# EAGLE design RPi_SPI_inputs_v01 (EAGLE 7.2.0)
AUTHOR: Petrilak M.; VERSION: 01
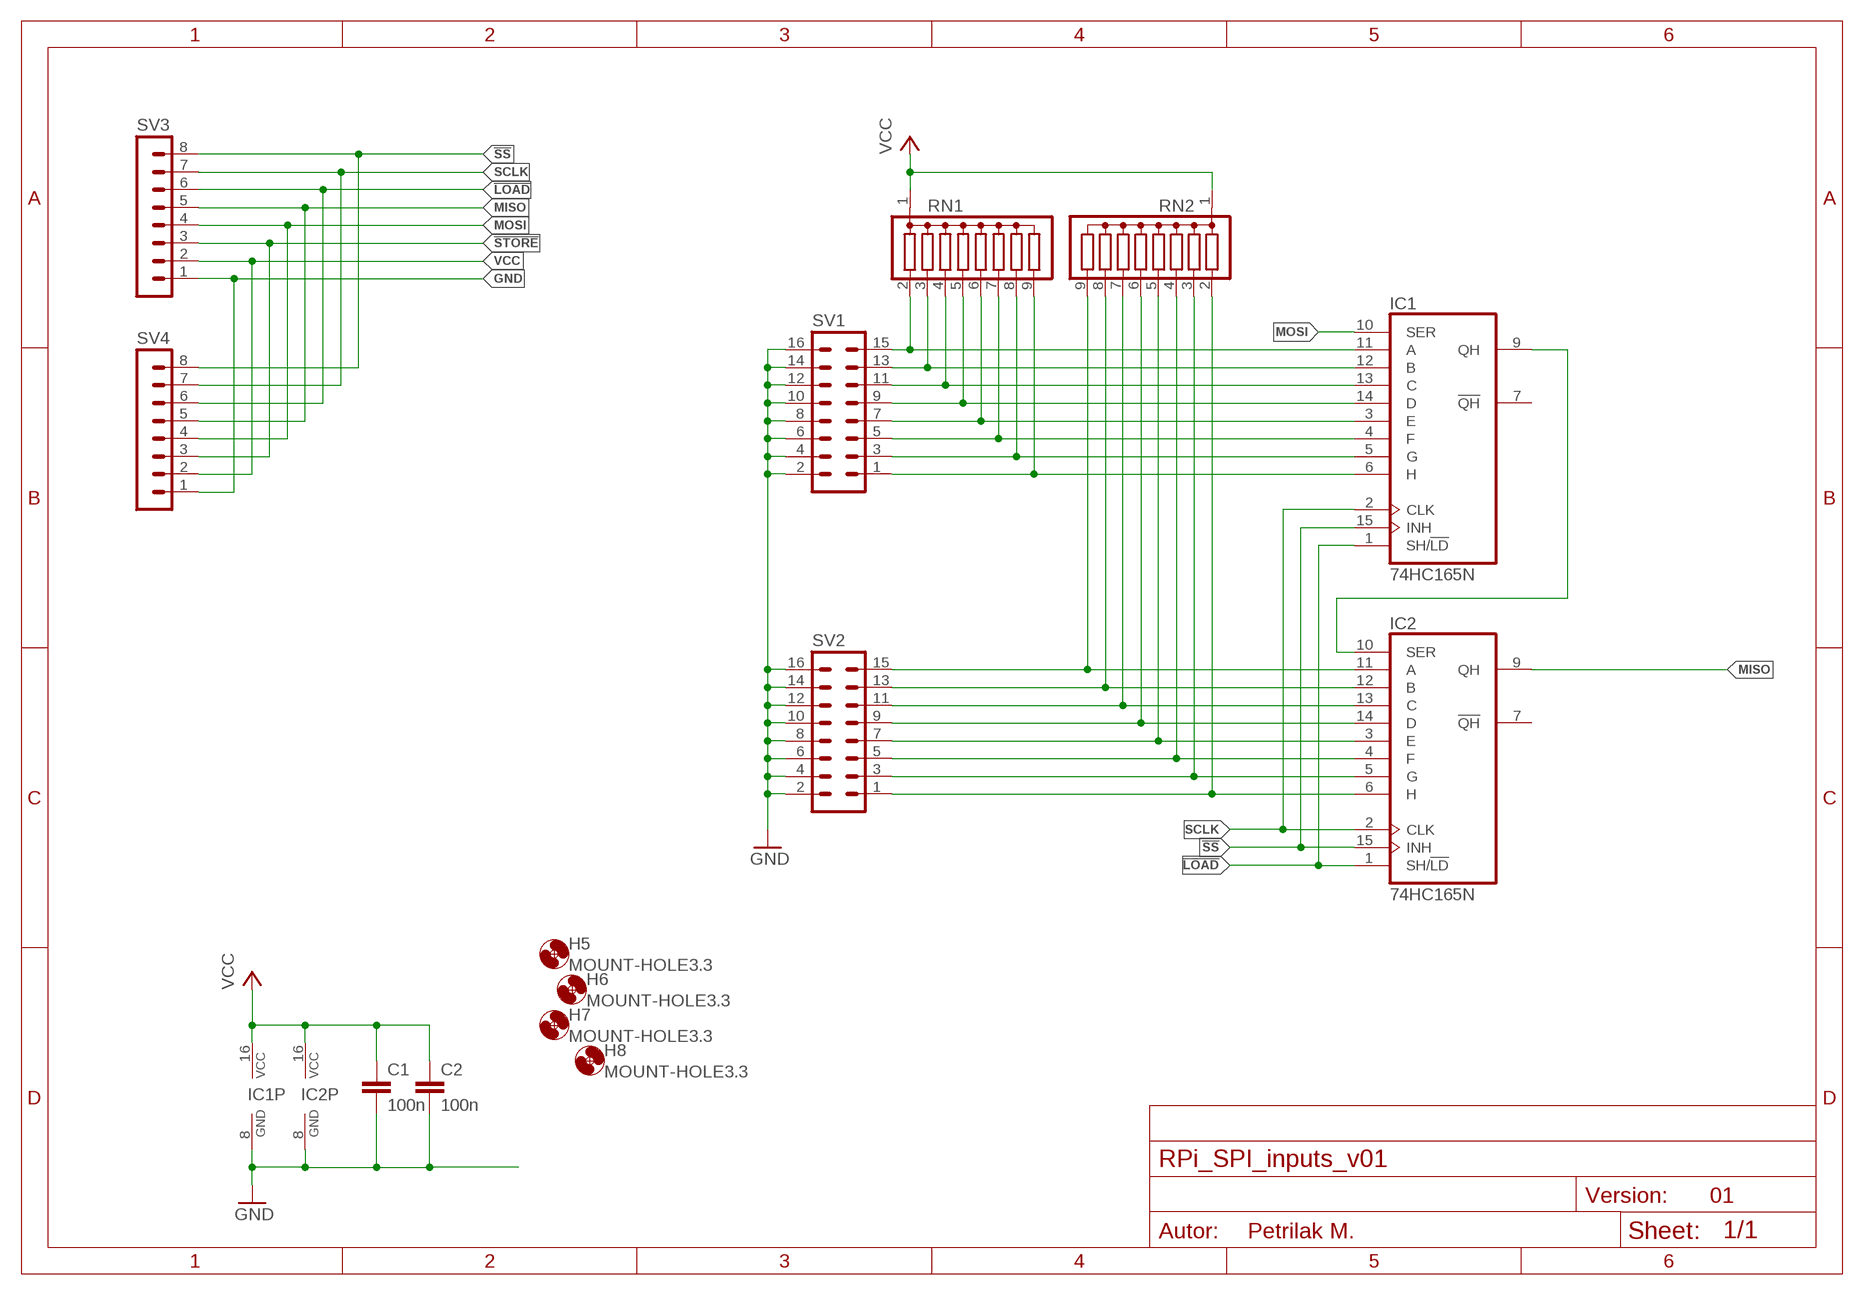
[diagram p0: schematic, sheet 1]

## Parts
C1  100n  C-EUC1206  [C1206]
C2  100n  C-EUC1206  [C1206]
H5  MOUNT-HOLE3.3  [3,3]
H6  MOUNT-HOLE3.3  [3,3]
H7  MOUNT-HOLE3.3  [3,3]
H8  MOUNT-HOLE3.3  [3,3]
IC1  74HC165N  [DIL16]
IC2  74HC165N  [DIL16]
RN1  G08R  [SIL9]
RN2  G08R  [SIL9]
SV1  MA08-2-OP  [MA08-2-OP]
SV2  MA08-2-OP  [MA08-2-OP]
SV3  MA08-1  [MA08-1]
SV4  MA08-1  [MA08-1]

## Nets
!LOAD: IC1.1(SH/!LD) IC2.1(SH/!LD) SV3.6 SV4.6
!SS: IC1.15(INH) IC2.15(INH) SV3.8 SV4.8
!STORE: SV3.3 SV4.3
GND: C1.2 C2.2 IC1.8(GND) IC2.8(GND) SV1.2 SV1.4 SV1.6 SV1.8 SV1.10 SV1.12 SV1.14 SV1.16 SV2.2 SV2.4 SV2.6 SV2.8 SV2.10 SV2.12 SV2.14 SV2.16 SV3.1 SV4.1
I00: IC1.11(A) RN1.2 SV1.15
I01: IC1.12(B) RN1.3 SV1.13
I06: IC1.5(G) RN1.8 SV1.3
I07: IC1.6(H) RN1.9 SV1.1
I08: IC2.11(A) RN2.9 SV2.15
I09: IC2.12(B) RN2.8 SV2.13
I10: IC2.13(C) RN2.7 SV2.11
I11: IC2.14(D) RN2.6 SV2.9
I12: IC2.3(E) RN2.5 SV2.7
I13: IC2.4(F) RN2.4 SV2.5
I14: IC2.5(G) RN2.3 SV2.3
I15: IC2.6(H) RN2.2 SV2.1
MISO: IC2.9(QH) SV3.5 SV4.5
MOSI: IC1.10(SER) SV3.4 SV4.4
N$1: IC1.9(QH) IC2.10(SER)
N$9: IC1.4(F) RN1.7 SV1.5
N$10: IC1.3(E) RN1.6 SV1.7
N$11: IC1.14(D) RN1.5 SV1.9
N$12: IC1.13(C) RN1.4 SV1.11
SCLK: IC1.2(CLK) IC2.2(CLK) SV3.7 SV4.7
VCC: C1.1 C2.1 IC1.16(VCC) IC2.16(VCC) RN1.1 RN2.1 SV3.2 SV4.2
Unconnected: IC1.7(!QH) IC2.7(!QH)

## Library data of the parts
C1 C2 = rcl:C-EU: CAPACITOR, European symbol
H5-H8 = holes:MOUNT-HOLE: MOUNTING HOLE with drill center marker
IC1 IC2 = 74xx-eu:74*165: 8-bit parallel load SHIFT REGISTER
RN1 RN2 = resistor-sil:G08R: SIL RESISTOR
SV1 SV2 = con-lstb:MA08-2: PIN HEADER
SV3 SV4 = con-lstb:MA08-1: PIN HEADER

## Board
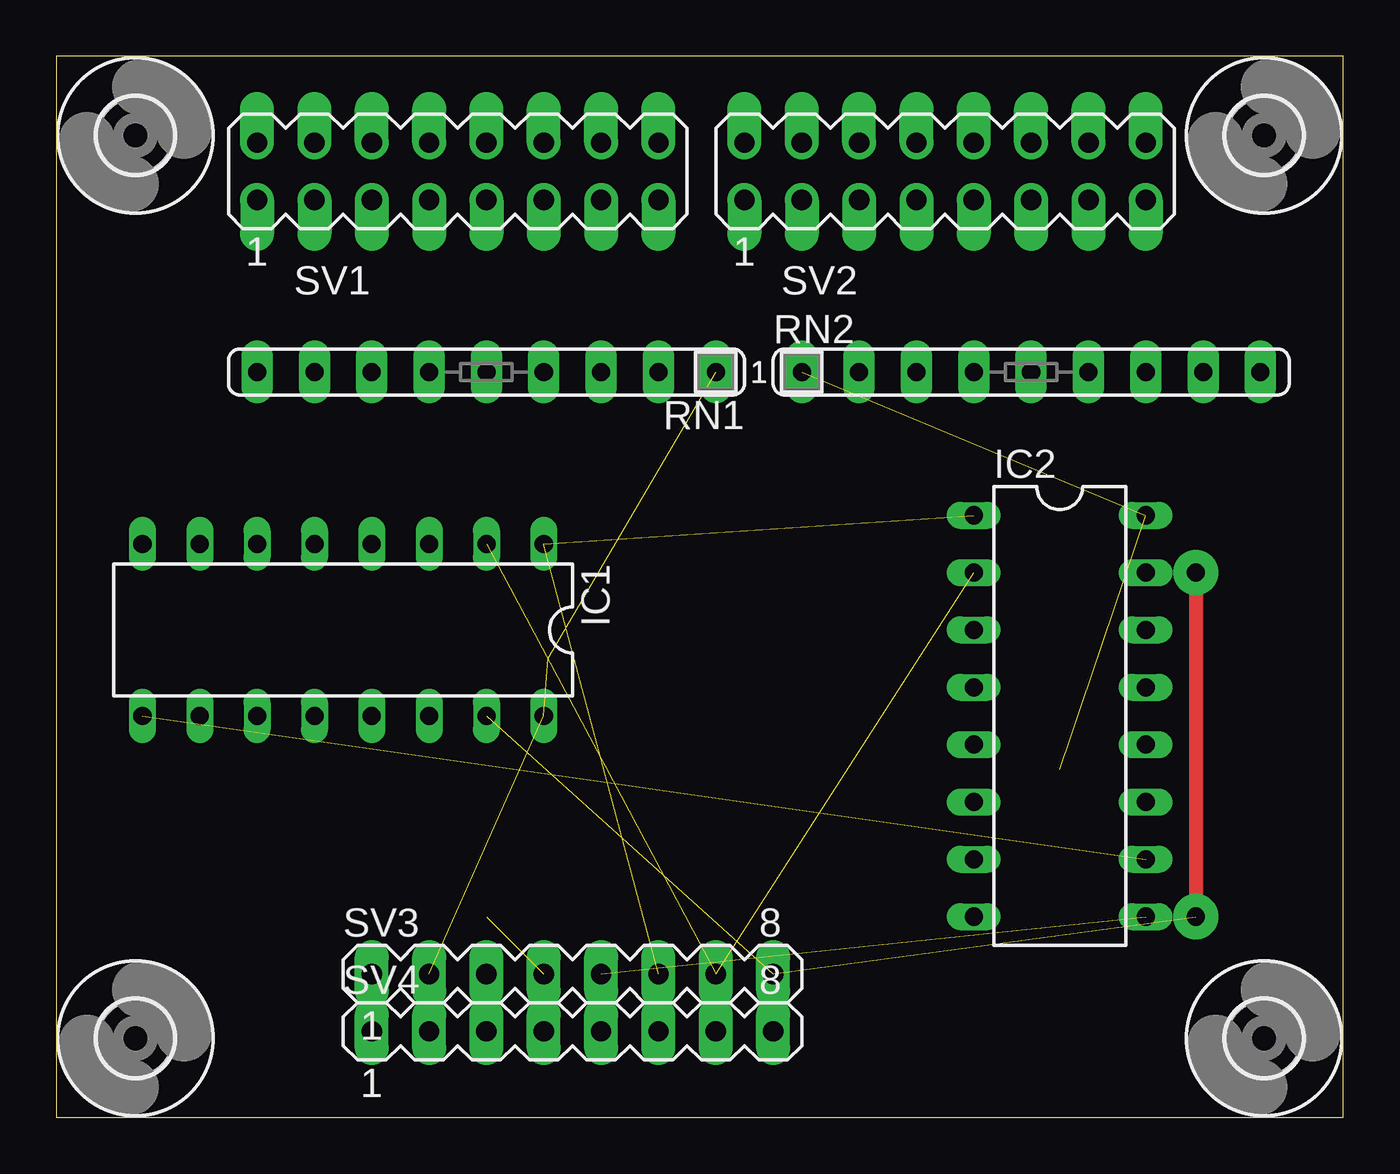
[diagram p1: board, top side]
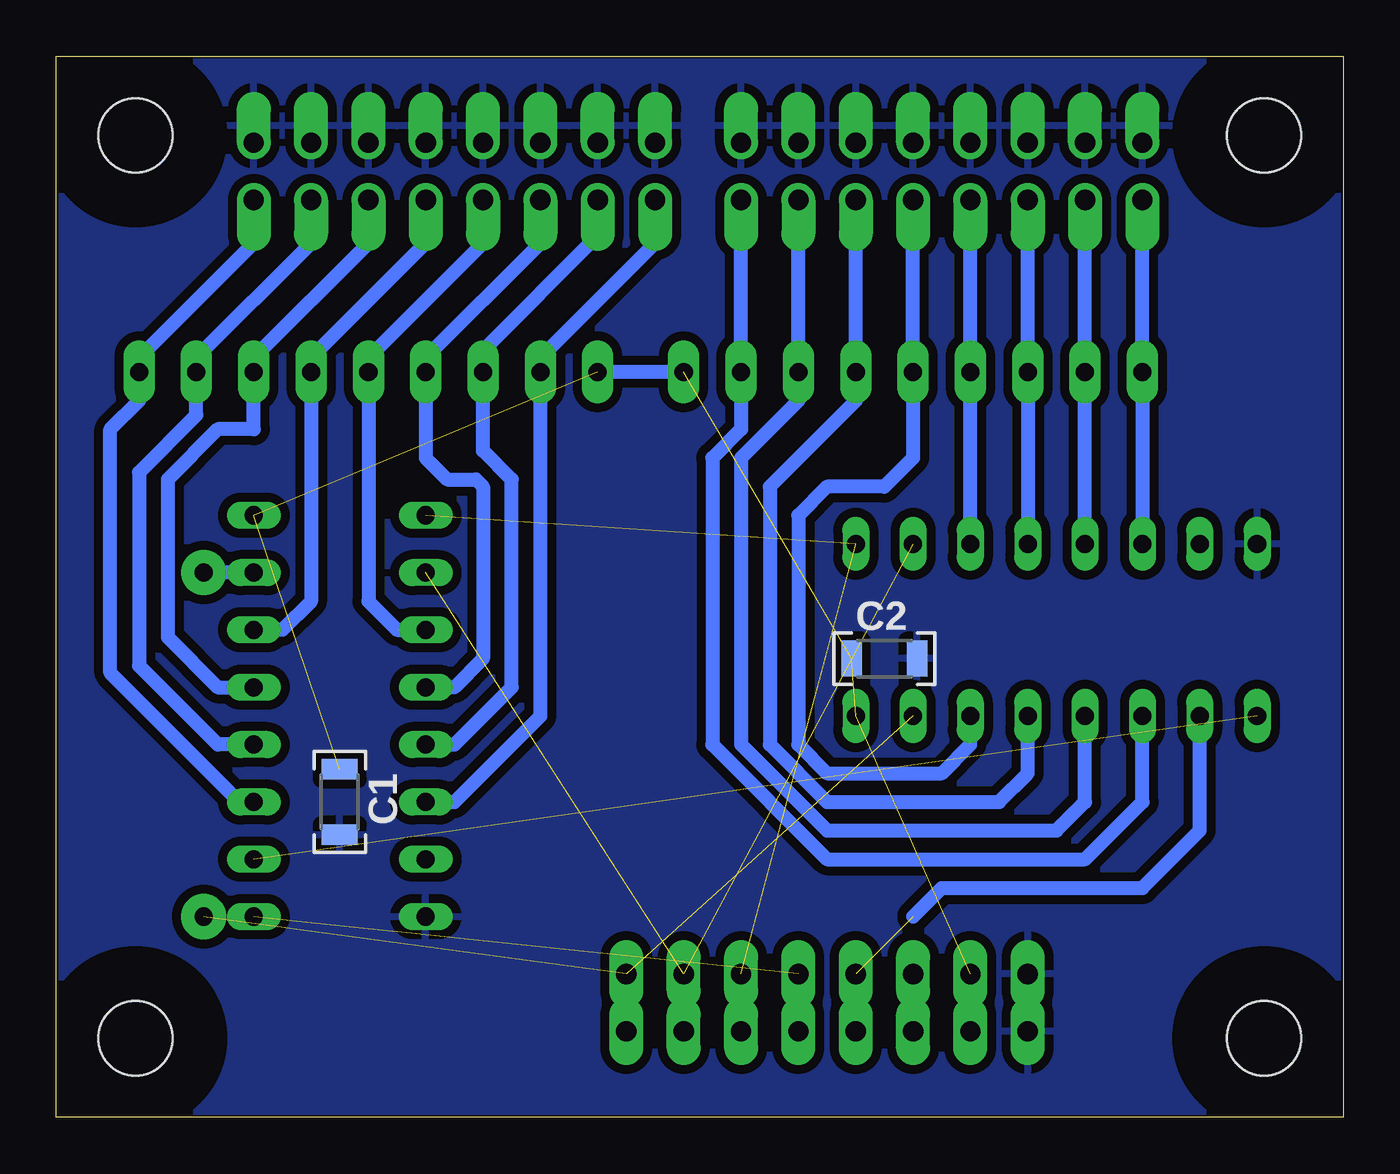
[diagram p2: board, bottom side, seen from below]

Size 57 x 47 mm. Coordinates in mm from the lower left corner, seen from the top.
Outline: 0,0 57,0 57,47 0,47 0,0
Copper layers (1*16): Top 0.035mm / dielectric 1.5mm / Bottom 0.035mm
Design rules "Michal_CNC_doma": minimum track width 0.3mm, minimum drill 0.6mm, track to track 0.4mm, track to pad 0.4mm, pad to pad 0.5mm, via to via 0.5mm, smd to smd 8mil, copper to edge 0.1mm, drill to drill 0.3mm, minimum pad ring 0.2mm, minimum via ring 0.2mm, stop-mask expansion 4mil, vias tented up to drill 0mil, thermal gap 0.4mm

### Footprints (pad centres in the part's own frame; a part is rotated, then mirrored left to right if it is on the bottom)
C1206 = smd 0.9 x 1.6: 1 -1.45,0; 2 1.45,0
3,3 = hole 3.3: 0,0
DIL16 = drill 0.8 long: 1 -8.89,-3.81; 2 -6.35,-3.81; 3 -3.81,-3.81; 4 -1.27,-3.81; 5 1.27,-3.81; 6 3.81,-3.81; 7 6.35,-3.81; 8 8.89,-3.81; 9 8.89,3.81; 10 6.35,3.81; 11 3.81,3.81; 12 1.27,3.81; 13 -1.27,3.81; 14 -3.81,3.81; 15 -6.35,3.81; 16 -8.89,3.81
SIL9 = drill 0.8 pad 1.4 long: 1 -10.16,0; 2 -7.62,0; 3 -5.08,0; 4 -2.54,0; 5 0,0; 6 2.54,0; 7 5.08,0; 8 7.62,0; 9 10.16,0
MA08-2-OP = drill 0.9 pad 1.5 offset: 1 -8.89,-1.27; 2 -8.89,1.27; 3 -6.35,-1.27; 4 -6.35,1.27; 5 -3.81,-1.27; 6 -3.81,1.27; 7 -1.27,-1.27; 8 -1.27,1.27; 9 1.27,-1.27; 10 1.27,1.27; 11 3.81,-1.27; 12 3.81,1.27; 13 6.35,-1.27; 14 6.35,1.27; 15 8.89,-1.27; 16 8.89,1.27
MA08-1 = drill 0.9 pad 1.5 long: 1 -8.89,0; 2 -6.35,0; 3 -3.81,0; 4 -1.27,0; 5 1.27,0; 6 3.81,0; 7 6.35,0; 8 8.89,0

### Placement (x,y rotation side)
C1  44.45,13.97 270 bottom
C2  20.32,20.32 0 bottom
H5  3.5,3.5 0 top
H6  53.5,3.5 0 top
H7  53.5,43.5 0 top
H8  3.5,43.5 0 top
IC1  12.7,21.59 180 top
IC2  44.45,17.78 270 top
RN1  19.05,33.02 180 top
RN2  43.18,33.02 0 top
SV1  17.78,41.91 0 top
SV2  39.37,41.91 0 top
SV3  22.86,6.35 0 top
SV4  22.86,3.81 0 top

### Tracks (layer width: path | path; a pad name or v marks a point on that pad's centre or on a via)
!LOAD  (2 unrouted)
  Bottom 0.61: SV4.6 SV3.6
!SS  (via drill 0.8 pad 2)  (2 unrouted)
  Top 0.61: v50.48,24.13 v50.48,8.89
  Bottom 0.61: SV4.8 SV3.8 | IC2.15 v50.48,24.13
!STORE
  Bottom 0.61: SV4.3 SV3.3
GND
  pour Bottom: 0,0 57,0 57,47 0,47
I00
  Bottom 0.61: IC1.11 8.89,13.97 11.43,11.43 22.86,11.43 27.94,16.51 27.94,29.21 26.67,30.48 RN1.2 SV1.15
I01
  Bottom 0.61: IC1.12 11.43,13.97 12.7,12.7 22.86,12.7 26.67,16.51 26.67,29.21 24.13,31.75 RN1.3 SV1.13
I06
  Bottom 0.61: IC1.5 RN1.8 SV1.3
I07
  Bottom 0.61: IC1.6 RN1.9 SV1.1
I08
  Bottom 0.61: SV2.15 48.26,38.73 53.34,33.66 RN2.9 53.34,31.75 54.61,30.48 54.61,19.68 48.9,13.97 IC2.11
I09
  Bottom 0.61: SV2.13 45.72,38.73 50.8,33.66 RN2.8 50.8,31.11 53.34,28.57 53.34,20 49.85,16.51 IC2.12
I10
  Bottom 0.61: SV2.11 43.18,38.73 48.26,33.66 RN2.7 48.26,30.48 49.85,30.48 52.07,28.26 52.07,21.27 49.85,19.05 IC2.13
I11
  Bottom 0.61: SV2.9 40.64,38.73 45.72,33.66 RN2.6 45.72,22.86 46.99,21.59 IC2.14
I12
  Bottom 0.61: SV2.7 38.1,38.73 43.18,33.66 RN2.5 43.18,22.86 41.91,21.59 IC2.3
I13
  Bottom 0.61: SV2.5 35.56,38.73 40.64,33.66 RN2.4 40.64,29.21 39.69,28.26 38.42,28.26 38.1,27.94 38.1,20.32 39.37,19.05 IC2.4
I14
  Bottom 0.61: SV2.3 33.02,39.05 38.1,33.97 RN2.3 38.1,29.53 36.83,28.26 36.83,19.05 39.37,16.51 IC2.5
I15
  Bottom 0.61: SV2.1 30.48,38.73 35.56,33.66 RN2.2 35.56,17.78 39.37,13.97 IC2.6
MISO  (1 unrouted)
  Bottom 0.61: SV4.5 SV3.5
MOSI  (1 unrouted)
  Bottom 0.61: 19.05,8.89 17.78,10.16 8.89,10.16 6.35,12.7 IC1.10 | SV4.4 SV3.4
N$1  (1 unrouted)
N$9
  Bottom 0.61: IC1.4 RN1.7 SV1.5
N$10
  Bottom 0.61: IC1.3 RN1.6 SV1.7
N$11
  Bottom 0.61: IC1.14 16.51,16.51 17.78,15.24 22.86,15.24 24.13,16.51 24.13,26.67 22.86,27.94 20.32,27.94 19.05,29.21 RN1.5 SV1.9
N$12
  Bottom 0.61: IC1.13 13.97,15.24 15.24,13.97 22.86,13.97 25.4,16.51 25.4,27.94 21.59,31.75 RN1.4 SV1.11
SCLK  (2 unrouted)
  Bottom 0.61: SV4.7 SV3.7
VCC  (5 unrouted)
  Bottom 0.61: SV4.2 SV3.2 | RN1.1 RN2.1